# EAGLE design Qwiic Sound Trigger (EAGLE 9.6.2)
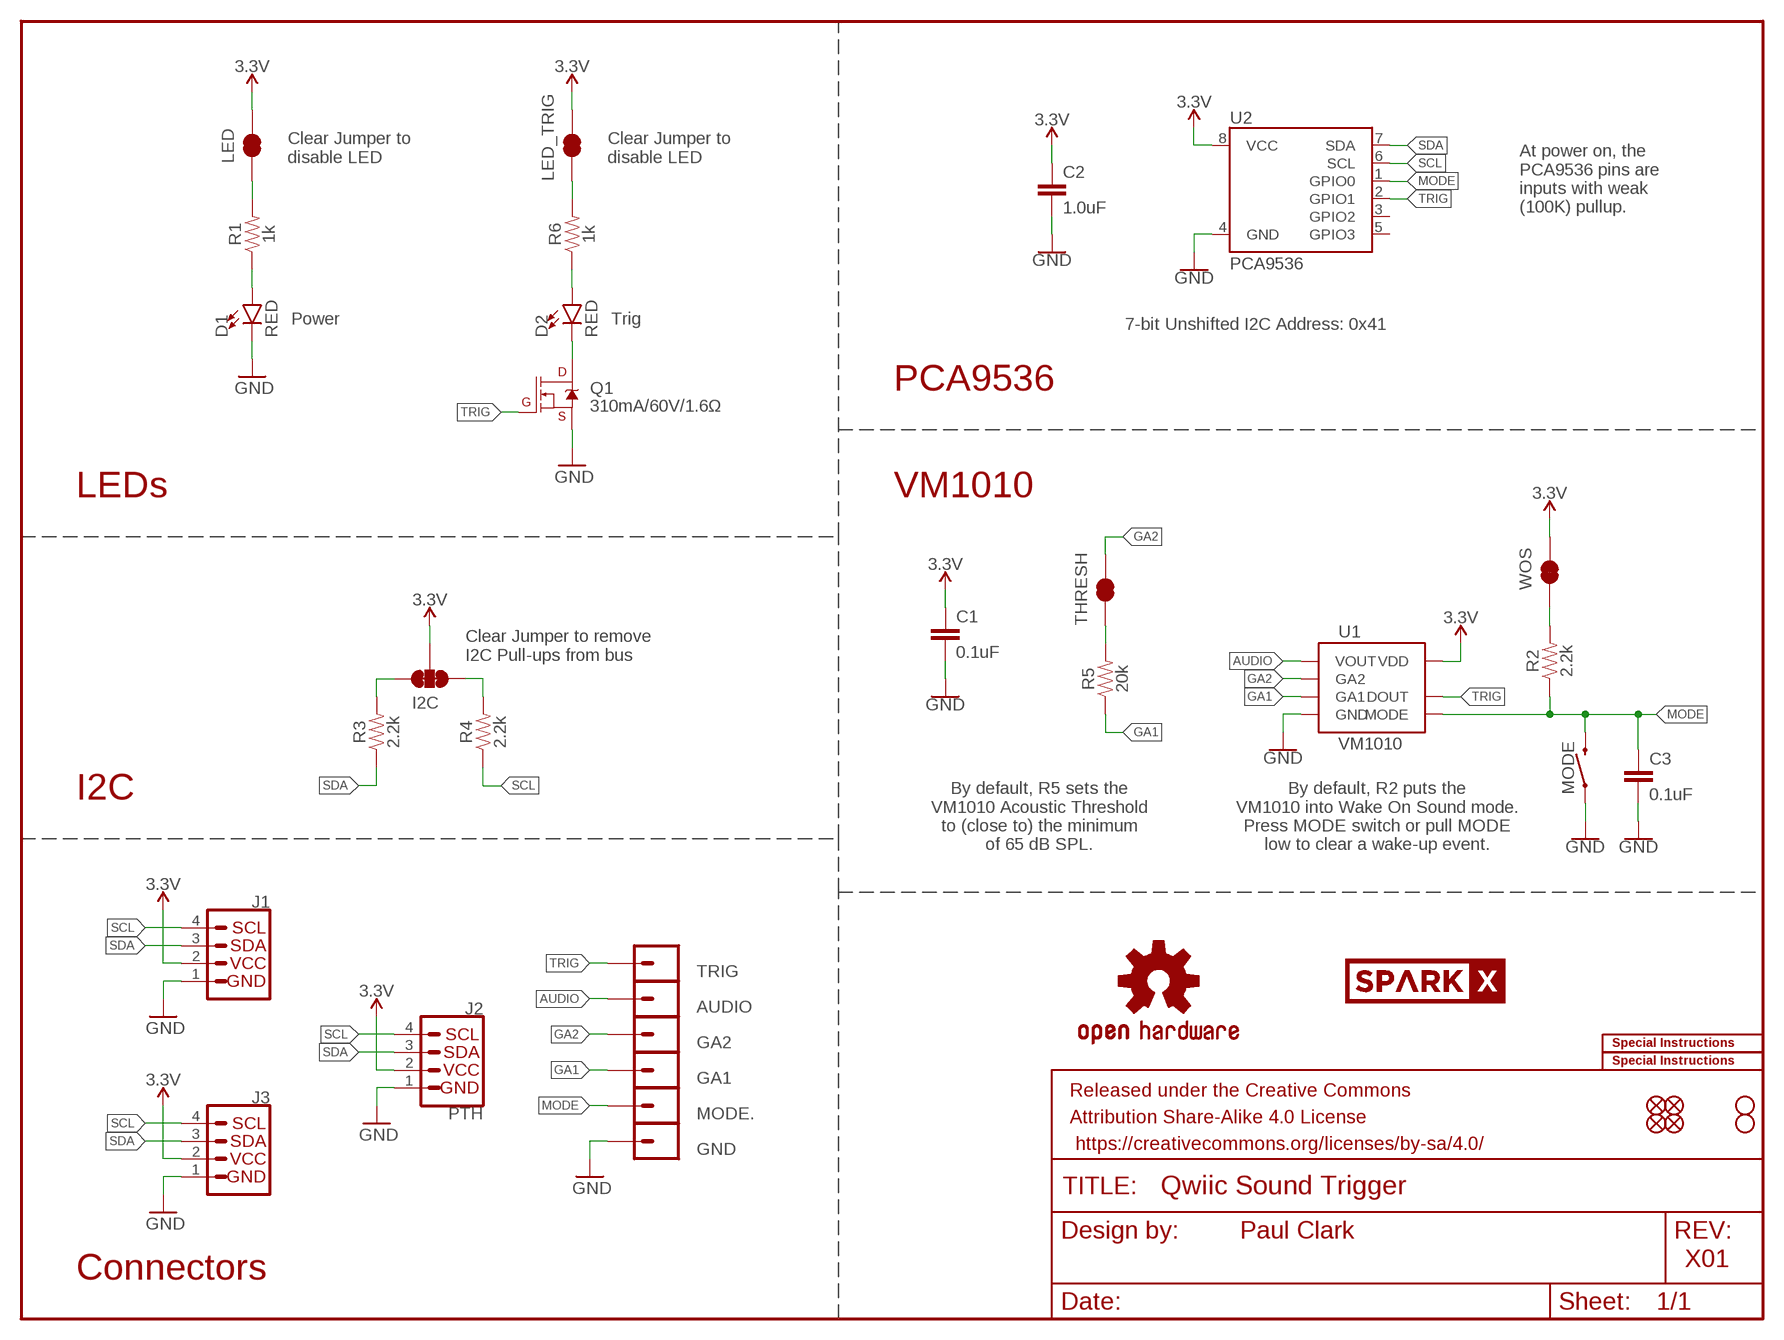
[diagram p0: schematic, sheet 1]

## Parts
AUDIO  CONN_01PTH_NO_SILK_YES_STOP  [1X01_NO_SILK]
C1  0.1uF  0.1UF-0603-25V-(+80/-20%)  [0603]
C2  1.0uF  1.0UF-0603-16V-10%-X7R  [0603]
C3  0.1uF  0.1UF-0603-25V-(+80/-20%)  [0603]
D1  RED  LED-RED0603  [LED-0603]
D2  RED  LED-RED0603  [LED-0603]
FRAME1  FRAME-LETTER  [CREATIVE_COMMONS]
GA1  CONN_01PTH_NO_SILK_YES_STOP  [1X01_NO_SILK]
GA2  CONN_01PTH_NO_SILK_YES_STOP  [1X01_NO_SILK]
GND  CONN_01PTH_NO_SILK_YES_STOP  [1X01_NO_SILK]
I2C  JUMPER-SMT_3_2-NC_TRACE_SILK  [SMT-JUMPER_3_2-NC_TRACE_SILK]
J1  Qwiic Right Angle  I2C_STANDARDQWIIC  [JST04_1MM_RA]
J2  PTH  I2C_STANDARD_NO_SILK  [1X04_NO_SILK]
J3  Qwiic Right Angle  I2C_STANDARDQWIIC  [JST04_1MM_RA]
JP1  FIDUCIAL1X2  [FIDUCIAL-1X2]
JP2  FIDUCIAL1X2  [FIDUCIAL-1X2]
JP3  STAND-OFF  [STAND-OFF]
JP4  STAND-OFF  [STAND-OFF]
JP5  FIDUCIAL1X2  [FIDUCIAL-1X2]
JP6  FIDUCIAL1X2  [FIDUCIAL-1X2]
LED  JUMPER-SMT_2_NC_TRACE_SILK  [SMT-JUMPER_2_NC_TRACE_SILK]
LED_TRIG  JUMPER-SMT_2_NC_TRACE_SILK  [SMT-JUMPER_2_NC_TRACE_SILK]
LOGO1  OSHW-LOGOMINI  [OSHW-LOGO-MINI]
LOGO2  SPECIAL_INSTRUCTIONS-ORDERING  [ORDERING_INSTRUCTIONS]
LOGO3  SPECIAL_INSTRUCTIONS-PRODUCTION  [PRODUCTION_INSTRUCTIONS]
MODE  MOMENTARY-SWITCH-SPST-SMD-4.6X2.8MM  [TACTILE_SWITCH_SMD_4.6X2.8MM]
MODE.  CONN_01PTH_NO_SILK_YES_STOP  [1X01_NO_SILK]
Q1  310mA/60V/1.6Ω  MOSFET-NCH-2N7002PW  [SOT323]
R1  1k  1KOHM-0603-1/10W-1%  [0603]
R2  2.2k  2.2KOHM-0603-1/10W-1%  [0603]
R3  2.2k  2.2KOHM-0603-1/10W-1%  [0603]
R4  2.2k  2.2KOHM-0603-1/10W-1%  [0603]
R5  20k  20KOHM-0603-1/10W-1%  [0603]
R6  1k  1KOHM-0603-1/10W-1%  [0603]
THRESH  JUMPER-SMT_2_NC_TRACE_SILK  [SMT-JUMPER_2_NC_TRACE_SILK]
TRIG  CONN_01PTH_NO_SILK_YES_STOP  [1X01_NO_SILK]
U1  VM1010  [VM1010]
U2  PCA9536  [MSOP8]
U$2  SPARKX-LOGO4  [SPARKX-MEDIUM]
WOS  JUMPER-SMT_2_NC_TRACE_SILK  [SMT-JUMPER_2_NC_TRACE_SILK]

## Nets
3.3V: C1.1 C2.1 I2C.2 J1.2 J2.2 J3.2 LED.2 LED_TRIG.2 U1.6(VDD) U2.8(VCC) WOS.2
AUDIO: AUDIO.1 U1.1(VOUT)
GA1: GA1.1 R5.1 U1.3(GA1)
GA2: GA2.1 THRESH.2 U1.2(GA2)
GND: C1.2 C2.2 C3.2 D1.C GND.1 J1.1 J2.1 J3.1 MODE.1 MODE.2 Q1.2(S) U1.4(GND) U1.8(GND) U2.4(GND)
MODE: C3.1 MODE.3 MODE.4 MODE..1 R2.1 U1.5(MODE) U2.1(GPIO0)
N$1: I2C.1 R4.2
N$2: I2C.3 R3.2
N$3: D1.A R1.1
N$4: LED.1 R1.2
N$5: R2.2 WOS.1
N$6: R5.2 THRESH.1
N$7: D2.A R6.1
N$8: LED_TRIG.1 R6.2
N$9: D2.C Q1.3(D)
SCL: J1.4 J2.4 J3.4 R4.1 U2.6(SCL)
SDA: J1.3 J2.3 J3.3 R3.1 U2.7(SDA)
TRIG: Q1.1(G) TRIG.1 U1.7(DOUT) U2.2(GPIO1)
Unconnected: U2.3(GPIO2) U2.5(GPIO3)

## Notes on the sheet
- Clear Jumper to 
  disable LED
- Clear Jumper to 
  disable LED
- At power on, the
  PCA9536 pins are
  inputs with weak
  (100K) pullup.
- Power | Trig
- 7-bit Unshifted I2C Address: 0x41
- PCA9536
- LEDs | VM1010
- Clear Jumper to remove
  I2C Pull-ups from bus
- By default, R5 sets the
  VM1010 Acoustic Threshold
  to (close to) the minimum
  of 65 dB SPL.
- By default, R2 puts the
  VM1010 into Wake On Sound mode.
  Press MODE switch or pull MODE
  low to clear a wake-up event.
- I2C
- Paul Clark
- X01
- Connectors

## Library data of the parts
AUDIO GA1 GA2 GND MODE. TRIG = SparkFun-Connectors:CONN_01: Single connection point. Often used as Generic Header-pin footprint for 0.1 inch spaced/style header connections On any of the 0.1 inch spaced packages, you can populate with these: Break Away Headers - Straight <https://www.sparkfun.com/products/116> (PRT-00116) Break Away Male Headers - Right Angle <https://www.sparkfun.com/products/553> (PRT-00553) Female Headers <https://www.sparkfun.com/products/115> (PRT-00115) Break Away Headers - Machine Pin <https://www.sparkfun.com/products/117> (PRT-00117) Break Away Female Headers - Swiss Machine Pin <https://www.sparkfun.com/products/743> (PRT-00743) This device is also useful as a general connection point to wire up your design to another part of your project. Our various solder wires solder well into these plated through hole pads. Hook-Up Wire - Assortment (Stranded, 22 AWG) <https://www.sparkfun.com/products/11375> (PRT-11375) Hook-Up Wire - Assortment (Solid Core, 22 AWG) <https://www.sparkfun.com/products/11367> (PRT-11367) View the entire wire category on our website here <https://www.sparkfun.com/categories/141> Special notes: SMTSO-256-ET is a "flush mount" nut for a 4-40 screw. We mostly use this on specialty testbeds; it is a nice way to connect hardware to your PCB at an adjustable hieght. Also note, the SNAP packages are for using a snappable style connector. We sell a baggie of snaps and they are also used on two LilyPad designs: Snap Assortment - 30 pack (male and female) <https://www.sparkfun.com/products/11347> (DEV-11347) LilyPad Arduino SimpleSnap <https://www.sparkfun.com/products/10941> (DEV-10941) LilyPad SimpleSnap Protoboard <https://www.sparkfun.com/products/10940> (DEV-10940)
C1 C3 = SparkFun-Capacitors:0.1UF: 0.1µF ceramic capacitors A capacitor is a passive two-terminal electrical component used to store electrical energy temporarily in an electric field.; PROD_ID: CAP-00810
C2 = SparkFun-Capacitors:1.0UF: 1µF ceramic capacitors A capacitor is a passive two-terminal electrical component used to store electrical energy temporarily in an electric field.; PROD_ID: CAP-13930
D1 D2 = SparkFun-LED:LED-RED: Red SMD LED Used in manufacturing of most products at SparkFun Packages: 0603 - SMD 0603 package [Product Link] <http://docs.avagotech.com/docs/AV02-0551EN> 0603 SMART - SMD 0603 SMART package ( more efficient and expensive)[Product Link] <http://www.osram-os.com/Graphics/XPic2/00077099_0.pdf> 1206 - SMD1206 package [Product Link] <https://www.sparkfun.com/datasheets/DevTools/LilyPad/Q150OVS4.pdff> SparkFun Products: Pro Mini 328 -5V <https://www.sparkfun.com/products/821> RedBoard <https://www.sparkfun.com/products/12757> IOIO-OTG <https://www.sparkfun.com/products/13613>; PROD_ID: DIO-00819
FRAME1 = SparkFun-Aesthetics:FRAME-LETTER: Schematic Frame - Letter Standard 8.5x11 US Letter frame
I2C = SparkFun-Jumpers:JUMPER-SMT_3_2-NC_TRACE: Normally closed trace jumper (2 of 2 connections) This jumper has a trace between all three pads so they are normally closed (NC). Use a razor knife to open the connection(s). For best results follow the IPC guidelines for cutting traces: Cutout at least 0.063 mm (0.005 in). Remove all loose material to clean up the cut area. Seal the cut with an approved epoxy. Reapply solder to reclose the connection(s).
J1 J3 = SparkFun-Connectors:I2C_STANDARD: SparkFun I2C Standard Pinout Header SparkFun has standardized on a pinout for all I2C based sensor breakouts. This pinout allows I2C boards to be plugged directly into the headers on Arduino Uno compatible boards, and to be daisy chained easily. Example SparkFun Products: SparkFun Atmospheric Sensor Breakout - BME280 <https://www.sparkfun.com/products/13676> SparkFun Altitude/Pressure Sensor Breakout - MPL3115A2 <https://www.sparkfun.com/products/11084> SparkFun TOF Range Finder Sensor - VL6180 <https://www.sparkfun.com/products/12785>; PROD_ID: CONN-13694
J2 = SparkFun-Connectors:I2C_STANDARD: SparkFun I2C Standard Pinout Header SparkFun has standardized on a pinout for all I2C based sensor breakouts. This pinout allows I2C boards to be plugged directly into the headers on Arduino Uno compatible boards, and to be daisy chained easily. Example SparkFun Products: SparkFun Atmospheric Sensor Breakout - BME280 <https://www.sparkfun.com/products/13676> SparkFun Altitude/Pressure Sensor Breakout - MPL3115A2 <https://www.sparkfun.com/products/11084> SparkFun TOF Range Finder Sensor - VL6180 <https://www.sparkfun.com/products/12785>
JP1 JP2 JP5 JP6 = SparkFun-Aesthetics:FIDUCIAL: Fiducial Alignment Points Point-of-reference for pick-and-place machines and other optical instruments.
JP3 JP4 = SparkFun-Hardware:STAND-OFF: Stand Off Drill holes for mechanically mounting via screws, standoffs, etc. Note: Use the keepout ring to avoid running the screw head into surrounding components. Variant Overviews STAND-OFF - Mechanical footprint for a #4 phillips button head screw. STAND-OFF-TIGHT - Mechanical footprint for a #4 phillips button head screw, Example SparkFun Products Screw - Phillips Head (1/4", 4-40, 10 pack) <https://www.sparkfun.com/products/10453> (PRT-10453) Screw - Phillips Head (1/2", 4-40, 10 pack) <https://www.sparkfun.com/products/10452> (PRT-10452) Screw - Phillips Head (3/4", 4-40, 10 pack) <https://www.sparkfun.com/products/10451> (PRT-10451) Screw - Phillips Head (1", 4-40, 10 pack) <https://www.sparkfun.com/products/10450> (PRT-10450)
LED LED_TRIG THRESH WOS = SparkFun-Jumpers:JUMPER-SMT_2_NC_TRACE: Normally closed trace jumper This jumper has a trace between two pads so it's normally closed (NC). Use a razor knife to open the connection. For best results follow the IPC guidelines for cutting traces: Cutout at least 0.063 mm (0.005 in). Remove all loose material to clean up the cut area. Seal the cut with an approved epoxy. Reapply solder to reclose the connection.
LOGO1 = SparkFun-Aesthetics:OSHW-LOGO: Open-Source Hardware (OSHW) Logo This logo indicates the piece of hardware it is found on incorporates a OSHW license and/or adheres to the definition of open source hardware found here: http://freedomdefined.org/OSHW
LOGO2 LOGO3 = SparkFun-Aesthetics:SPECIAL_INSTRUCTIONS: Special Ordering/Production Instructions Alert Symbol for special PCB ordering instructions or unique production process warnings. Ordering Instructions Production Instructions Types of information that should be added to box: Copper weight Soldermask color Silk color PCB thickness Number of layers PCB Standard: 1.6mm FR4 1 oz copper immersion silver plating red soldermask white silkscreen Types of information that should be added to box: Special wash requirements Depaneling instructions Humidification Glue curing Default text settings: 0.07 inch 9% ratio 50% line distance
MODE = SparkFun-Switches:MOMENTARY-SWITCH-SPST: Momentary Switch (Pushbutton) - SPST Normally-open (NO) SPST momentary switches (buttons, pushbuttons). Variants PTH-12MM - 12mm square, through-hole Momentary Pushbutton Switch - 12mm Square <https://www.sparkfun.com/products/9190> (COM-09190) PTH-6.0MM, PTH-6.0MM-KIT - 6.0mm square, through-hole Mini Pushbutton Switch <https://www.sparkfun.com/products/97> (COM-00097) KIT package intended for soldering kit's - only one side of pads' copper is exposed. PTH-RIGHT-ANGLE-KIT - Right-angle, through-hole Right Angle Tactile Button <https://www.sparkfun.com/products/10791> - Used on SparkFun BigTime Watch Kit <https://www.sparkfun.com/products/11734> SMD-12MM - 12mm square, surface-mount Tactile Button - SMD (12mm) <https://www.sparkfun.com/products/12993> (COM-12993) Used on SparkFun PicoBoard <https://www.sparkfun.com/products/11888> SMD-4.5MM - 4.5mm Square Trackball Switch Used on SparkFun Blackberry Trackballer Breakout <https://www.sparkfun.com/products/13169> SMD-4.6MMX2.8MM - 4.60mm x 2.80mm, surface mount Used on SparkFun SAMD21 Mini Breakout <https://www.sparkfun.com/products/13664> SMD-5.2MM, SMD-5.2-REDUNDANT - 5.2mm square, surface-mount Mini Pushbutton Switch - SMD <https://www.sparkfun.com/products/8720> (COM-08720) Used on Arduino Pro Mini <https://www.sparkfun.com/products/11114> REDUNDANT package connects both switch circuits together SMD-6.0X3.5MM - 6.0 x 3.5mm, surface mount Momentary Reset Switch SMD <https://www.sparkfun.com/products/8229> (COM-08229) SMD-6.2MM-TALL - 6.2mm square, surface mount Tactile Button - SMD (6mm) <https://www.sparkfun.com/products/12992> Used on SparkFun Digital Sandbox <https://www.sparkfun.com/products/12651> SMD-RIGHT-ANGLE - Right-angle, surface mount Used on SparkFun Block for Intel® Edison - Arduino <https://www.sparkfun.com/products/13036>; PROD_ID: SWCH-13065
Q1 = SparkFun-DiscreteSemi:MOSFET-NCH: N-channel MOSFETs Voltage controlled devices that allow control of high current outputs. SparkFun Products: SparkFun OpenScale <https://www.sparkfun.com/products/13261> SparkFun Digital Sandbox <https://www.sparkfun.com/products/12651> SparkFun Monster Moto Shield <https://www.sparkfun.com/products/10182> SparkFun MOSFET Power Controller <https://www.sparkfun.com/products/11214>; PROD_ID: TRANS-11151
R1 R6 = SparkFun-Resistors:1KOHM: 1kΩ resistor A resistor is a passive two-terminal electrical component that implements electrical resistance as a circuit element. Resistors act to reduce current flow, and, at the same time, act to lower voltage levels within circuits. - Wikipedia; PROD_ID: RES-07856
R2-R4 = SparkFun-Resistors:2.2KOHM: 2.2kΩ resistor A resistor is a passive two-terminal electrical component that implements electrical resistance as a circuit element. Resistors act to reduce current flow, and, at the same time, act to lower voltage levels within circuits. - Wikipedia; PROD_ID: RES-08272
R5 = SparkFun-Resistors:20KOHM: 20kΩ resistor A resistor is a passive two-terminal electrical component that implements electrical resistance as a circuit element. Resistors act to reduce current flow, and, at the same time, act to lower voltage levels within circuits. - Wikipedia; PROD_ID: RES-09383
U1 = SparkFun-Sensors:VM1010: Vesper Technologies VM1010 The VM1010 is the world’s first ZeroPower ListeningTM piezoelectric MEMS microphone. It provides an ultra-low power always listening solution with a Wake on Sound mode that allows detection of voice activity.; DIGIKEY_PART: 2022-1001-1-ND; MANU_PART: VM1010AA; PROD_ID: IC-15768
U2 = SparkFun-IC-Conversion:PCA9536: PCA9536 4-Bit I2C I/O Expander; PROD_ID: IC-15034
U$2 = SparkX:SPARKX-LOGO

## Net classes
1 power: width 0.203 mm

## Board
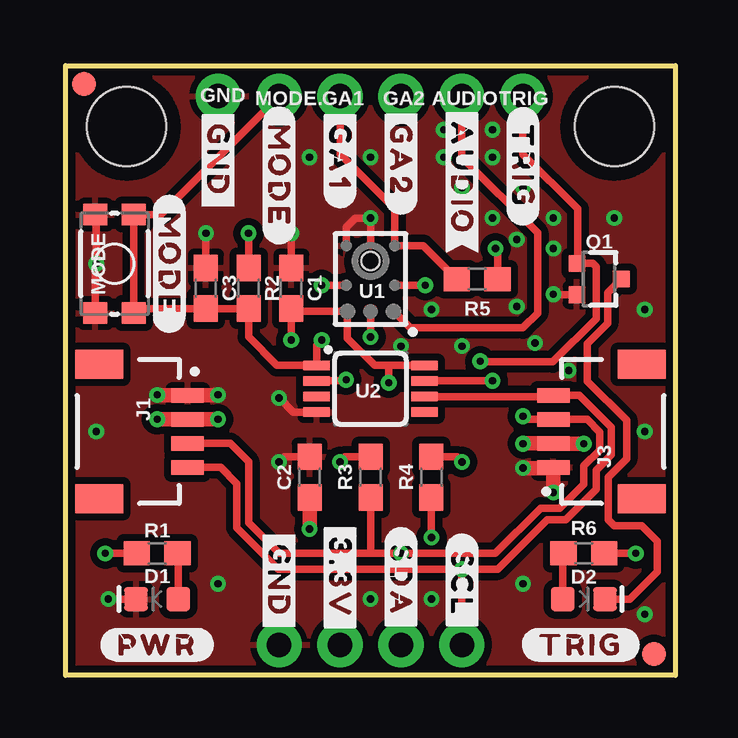
[diagram p1: board, top side]
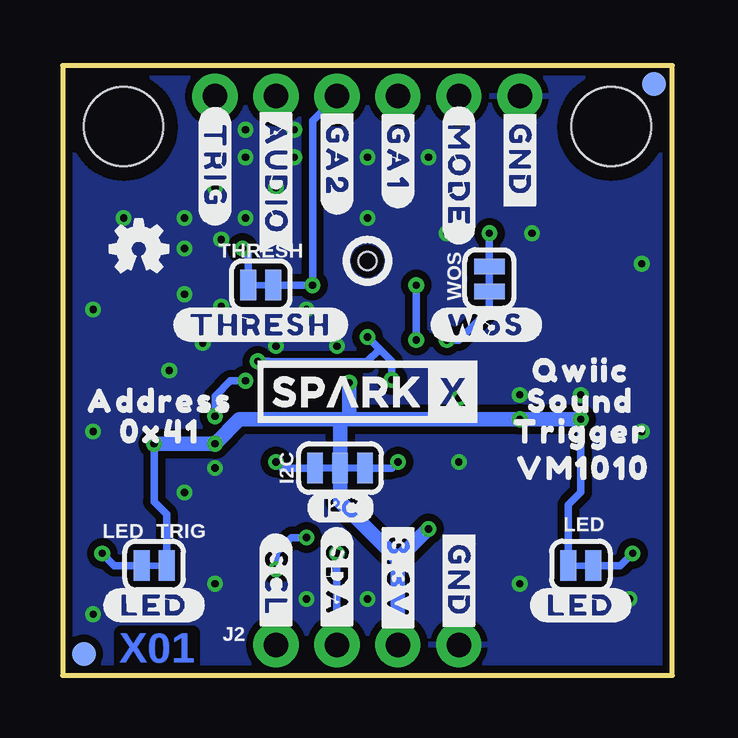
[diagram p2: board, bottom side, seen from below]

Size 25.4 x 25.4 mm. Coordinates in mm from the lower left corner, seen from the top.
Outline: 0,0 0,25.4 25.4,25.4 25.4,0 0,0
Copper layers (1*16): Top 0.035mm / dielectric 1.5mm / Bottom 0.035mm
Design rules "SparkFun-2-Layer-General-JLCPCB": minimum track width 7mil, minimum drill 0.3mm, track to track 7mil, track to pad 7mil, pad to pad 7mil, via to via 7mil, smd to smd 7mil, copper to edge 7mil, drill to drill 7mil, minimum pad ring 7mil, minimum via ring 7mil, stop-mask expansion 3mil, vias tented up to drill 25mil, thermal gap 10mil

### Footprints (pad centres in the part's own frame; a part is rotated, then mirrored left to right if it is on the bottom)
1X01_NO_SILK = drill 1.016 pad 1.88: 1 0,0
0603 = smd 1.1 x 1: 1 -0.85,0; 2 0.85,0
LED-0603 = smd 1 x 1: A -0.877,0; C 0.877,0
SMT-JUMPER_3_2-NC_TRACE_SILK = smd 0.66 x 1.27: 1 -1.041,0; 2 0,0; 3 1.041,0
JST04_1MM_RA = smd 0.6 x 1.35: 1 -1.5,0; 2 -0.5,0; 3 0.5,0; 4 1.5,0 | smd 1.2 x 2: NC1 2.8,-3.675; NC2 -2.8,-3.675
1X04_NO_SILK = drill 1.016 pad 1.88: 1 0,0; 2 2.54,0; 3 5.08,0; 4 7.62,0
FIDUCIAL-1X2 = smd 1 x 1: 1 0,0
STAND-OFF = hole 3.302: 0,0
SMT-JUMPER_2_NC_TRACE_SILK = smd 0.66 x 1.27: 1 -0.521,0; 2 0.521,0
TACTILE_SWITCH_SMD_4.6X2.8MM = smd 0.9 x 1: 1 -2.05,-0.8; 2 2.05,-0.8; 3 2.05,0.8; 4 -2.05,0.8
SOT323 = smd 0.7 x 0.7: 1 -0.65,-0.925; 2 0.65,-0.925; 3 0,0.925
VM1010 = smd 0.65 x 0.65: 1 1.35,0.965; 6 1.35,-0.965 | smd 0.46 x 0.46: 2 0.25,1.015; 3 -1.39,1.015; 4 -1.39,-1.015; 5 0.25,-1.015 | smd 0.6 x 0.6: 7 1.35,0 | smd 0.25 x 0.25: 8 -1.38,0 | hole 0.75: -0.75,0
MSOP8 = smd 1.1 x 0.4: 1 -2.25,0.975; 2 -2.25,0.325; 3 -2.25,-0.325; 4 -2.25,-0.975; 5 2.25,-0.975; 6 2.25,-0.325; 7 2.25,0.325; 8 2.25,0.975

### Placement (x,y rotation side)
AUDIO  16.51,24.13 0 top
C1  9.4,16.13 90 top
C2  10.16,8.26 90 top
C3  5.84,16.13 90 top
D1  3.81,3.17 180 top
D2  21.59,3.17 0 top
FRAME1  54.61,-10.16 0 top  (outside the outline)
GA1  11.43,24.13 0 top
GA2  13.97,24.13 0 top
GND  6.35,24.13 0 top
I2C  13.84,8.64 0 bottom
J1  5.08,10.16 270 top
J2  8.89,1.27 180 bottom
J3  20.32,10.16 90 top
JP1  0.76,24.64 0 bottom
JP2  24.51,0.89 0 top
JP3  2.54,22.86 0 top
JP4  22.86,22.86 0 top
JP5  24.51,0.89 0 bottom
JP6  0.76,24.64 0 top
LED  3.81,4.57 180 bottom
LED_TRIG  21.59,4.57 0 bottom
LOGO1  22.23,17.78 0 bottom
LOGO2  34.29,50.8 0 top  (outside the outline)
LOGO3  34.29,105.41 0 top  (outside the outline)
MODE  2.03,17.14 270 top
MODE.  8.89,24.13 0 top
Q1  22.23,16.51 270 top
R1  3.81,5.08 180 top
R2  7.62,16.13 90 top
R3  12.7,8.26 90 top
R4  15.24,8.26 90 top
R5  17.14,16.51 0 top
R6  21.59,5.08 0 top
THRESH  17.14,16.26 0 bottom
TRIG  19.05,24.13 0 top
U1  12.7,16.51 270 top
U2  12.7,11.94 0 top
U$1  [#GA1#0]  11.43,21.59 270 top
U$2  12.7,11.81 0 bottom
U$3  [#GA1#0]  11.43,21.59 270 bottom
U$4  [#GA2#0]  13.97,21.46 270 top
U$5  [#GA2#0]  13.97,21.46 270 bottom
U$6  [#AUDIO#0]  16.51,20.7 270 top
U$7  [#AUDIO#0]  16.51,20.7 270 bottom
U$8  [#MODE#0]  8.89,20.83 270 top
U$9  [#MODE#0]  8.89,20.83 270 bottom
U$10  [I_SUPER2_C-()-03]  15.24,6.99 0 bottom
U$11  [#TRIG#0]  19.05,21.21 270 top
U$12  [#TRIG#0]  19.05,21.21 270 bottom
U$13  [#PWR#0]  3.81,1.27 0 top
U$14  [#LED#0]  3.81,2.92 0 bottom
U$15  [#THRESH#0]  17.14,14.61 0 bottom
U$16  [#WOS#0]  7.75,14.61 0 bottom
U$17  [#GND#0]  8.89,3.94 270 top
U$18  [#GND#0]  8.89,3.94 270 bottom
U$19  [#3#3V#0]  11.43,4.06 270 top
U$20  [#3#3V#0]  11.43,4.06 270 bottom
U$21  [#SDA#0]  13.97,3.94 270 top
U$22  [#SDA#0]  13.97,3.94 270 bottom
U$23  [#SCL#0]  16.51,3.81 270 top
U$24  [#SCL#0]  16.51,3.81 270 bottom
U$25  [#MODE#0]  4.32,17.14 270 top
U$29  [QWIIC0]  3.81,12.7 0 bottom
U$30  [SOUND0]  3.81,11.43 0 bottom
U$31  [TRIGGER0]  3.81,10.16 0 bottom
U$32  [VM10100]  3.68,8.64 0 bottom
U$33  [ADDRESS0]  21.34,11.43 0 bottom
U$34  [0X410]  21.34,10.16 0 bottom
U$35  [#TRIG#0]  21.46,1.27 0 top
U$36  [#LED#0]  21.59,2.92 0 bottom
U$38  [#GND#0]  6.35,21.46 270 bottom
U$39  [#GND#0]  6.35,21.46 270 top
WOS  7.62,16.51 270 bottom

### Tracks (layer width: path | path; a pad name or v marks a point on that pad's centre or on a via)
3.3V  (via drill 0.3)
  Top 0.254: v3.82,10.66 v3.81,10.67
  Top 0.305: v9.4,13.97 C1.1 9.52,15.16 U1.6 11.73,14.05 12.87,12.91 13.46,12.91 | 13.46,12.91 U2.8 | v13.46,12.19 13.46,12.91
  Top 0.61: v3.82,10.66 J1.2 v6.35,10.67 | v19.05,9.65 v19.06,9.66 J3.2 v21.59,9.65 | C2.1 v10.16,6.1
  Bottom 0.305: WOS.2 7.62,15.24 8.89,13.97 v9.4,13.97 | v21.59,9.65 21.59,7.24 21.07,6.72 LED_TRIG.2 | v3.81,10.67 3.81,7.62 4.33,7.1 LED.2
  Bottom 0.61: v3.81,10.67 v6.35,10.67 13.46,10.67 | 13.46,10.67 13.84,10.67 | 13.84,10.67 18.03,10.67 v19.05,9.65 v21.59,9.65 | 13.84,10.67 I2C.2 13.84,7.24 11.43,4.83 | v13.46,12.19 13.46,10.67 | v10.16,6.1 11.43,4.83 | 11.43,4.83 J2.2
AUDIO
  Top 0.305: U1.1 14.35,14.48 19.05,14.48 19.66,15.09 19.66,18.44 16.51,21.59 AUDIO.1
GA1
  Top 0.305: GA1.1 11.43,21.72 13.71,19.43 U1.3 14.9,17.9 R5.1
GA2  (via drill 0.3)
  Top 0.305: U1.2 v14.98,16.26 v14.99,16.26
  Bottom 0.305: THRESH.2 v14.99,16.26 14.99,23.11 GA2.1
GND  (via drill 0.3)
  Top 0.305: D1.C v1.78,3.17 | C3.2 v5.84,18.41 | C1.2 v9.4,18.41 | MODE.1 1.27,19.16 v1.27,17.14 1.23,17.11 MODE.2 | U2.4 9.48,10.96 v8.89,11.56 | C2.2 9.11,9.11 v8.89,8.89 | Q1.2 20.34,15.86 v20.32,15.88 | U1.8 v12.7,19.05 12.06,19.05 11.69,18.67 U1.4
  Top 0.61: v3.81,11.68 3.83,11.66 J1.1 6.33,11.66 v6.35,11.68 | v19.05,8.64 20.3,8.64 J3.1 v20.32,7.62
  other vias: 1.27,10.16 24.13,10.16 6.35,3.81 19.05,3.81 15.24,15.24 13.97,13.72 16.51,13.72 19.56,13.84 18.8,15.37 18.8,18.16 16.51,20.32 17.78,19.05 17.78,21.59 19.05,20.32 20.32,19.05 20.32,17.78 15.75,21.59 15.75,22.73 17.78,22.73 24.13,15.24 22.86,19.05 10.16,21.59 12.7,3.17 15.24,3.17 24.13,2.54 12.7,21.59 20.95,12.7
  pour Bottom (isolate 0.305): 0,0 0,25.4 25.4,25.4 25.4,0
  pour Top (isolate 0.305): 0,0 0,25.4 25.4,25.4 25.4,0
MODE  (via drill 0.3)
  Top 0.305: v10.67,13.97 10.45,13.75 U2.1 8.8,12.91 7.62,14.1 R2.1 C3.1 3.02,15.28 MODE.3 MODE.4 3.96,19.2 MODE..1 | U1.5 v10.67,16.26
  Bottom 0.305: v10.67,13.97 v10.67,16.26
N$1  (via drill 0.3)
  Top 0.305: R4.2 16.3,9.11 v16.51,8.89
  Bottom 0.305: v16.51,8.89 16.26,8.64 I2C.1
N$2  (via drill 0.3)
  Top 0.305: v11.43,8.89 11.64,9.11 R3.2
  Bottom 0.305: I2C.3 11.68,8.64 v11.43,8.89
N$3
  Top 0.305: R1.1 4.69,5.05 D1.A
N$4  (via drill 0.3)
  Top 0.305: v1.65,5.08 R1.2
  Bottom 0.305: LED.1 2.16,4.57 v1.65,5.08
N$5  (via drill 0.3)
  Top 0.305: R2.2 v7.62,18.41
  Bottom 0.305: v7.62,18.41 WOS.1
N$6  (via drill 0.3)
  Top 0.305: R5.2 18,17.69 v17.91,17.78
  Bottom 0.305: v17.91,17.78 17.67,17.54 THRESH.1
N$7
  Top 0.305: R6.1 20.71,5.05 D2.A
N$8  (via drill 0.3)
  Top 0.305: v23.75,5.08 R6.2
  Bottom 0.305: LED_TRIG.1 23.24,4.57 v23.75,5.08
N$9
  Top 0.305: D2.C 23.5,3.17 24.64,4.32 24.64,5.59 24,6.22 22.86,6.22 22.61,6.48 22.61,8.26 23.37,9.02 23.37,10.63 21.74,12.26 21.74,13.82 22.58,14.66 22.58,15.94 Q1.3
SCL  (via drill 0.3)
  Top 0.305: R4.1 v15.24,5.74 | v16.51,4.42 J2.4 | J1.4 6.45,8.66 7.14,7.98 7.14,6.15 8.87,4.42 v16.51,4.42 | v16.51,4.42 18.01,4.42 20.07,6.48 20.83,6.48 22.1,7.75 22.1,8.55 22.73,9.18 22.73,10.34 21.41,11.66 J3.4 20.27,11.61 U2.6
  Bottom 0.305: v15.24,5.74 15.88,5.74 16.51,5.1 v16.51,4.42
SDA  (via drill 0.3)
  Top 0.305: J1.3 6.85,9.66 7.62,8.89 7.62,6.35 8.89,5.08 12.7,5.08 | 12.7,5.08 R3.1 | 12.7,5.08 v13.97,5.08 17.91,5.08 19.79,6.96 20.59,6.96 21.59,7.96 21.59,8.72 22.25,9.38 22.25,10.14 21.73,10.66 J3.3 19.19,10.66 v19.05,10.8 | v17.78,12.27 v17.77,12.26 U2.7
  Bottom 0.305: v13.97,5.08 J2.3 | v19.05,10.8 19.05,11.63 18.41,12.27 v17.78,12.27
TRIG  (via drill 0.3)
  Top 0.305: U1.7 v12.7,14.1 | v11.68,12.32 11.63,12.26 U2.2 | TRIG.1 19.05,21.72 21.34,19.43 21.34,17.2 Q1.1 21.96,17.16 22.1,17.02 22.1,14.86 20.3,13.06 17.3,13.06 v17.27,13.08
  Bottom 0.305: 12.19,13.59 11.68,13.08 v11.68,12.32 | 12.19,13.59 v12.7,14.1 | v17.27,13.08 16.81,13.08 16.78,13.06 12.72,13.06 12.19,13.59

### Text on the board
Bottom: X01
Measures: Dimensions in inches
tDocu: Do not board wash or clean after the reflow process / or expose the acoustic port to harsh chemicals. | 2-Layer board / 1.6mm thickness / HASL finish | Paul Clark